# Altium schematic sheet Scheme_E3.SchDoc
size 420 x 297 mm; CheckedBy: Суворов; Address1: Address1; Address2: Address2; Address3: Address3; Address4: Address4; DocumentNumber: АБВГ.941319.001 Э3; SheetNumber: 1; SheetTotal: 1; DocumentType: Схема электрическая принципиальная; FirstReferrence: АБВГ.941319.001; DevelopedBy: Паймин; University: МГТУ им. Н. Э. Баумана; Department: Кафедра СМ5; Group: Группа СМ5-71; Title2str: Малогабаритный; Title3str: биопульсомер; TotalSheets: 1
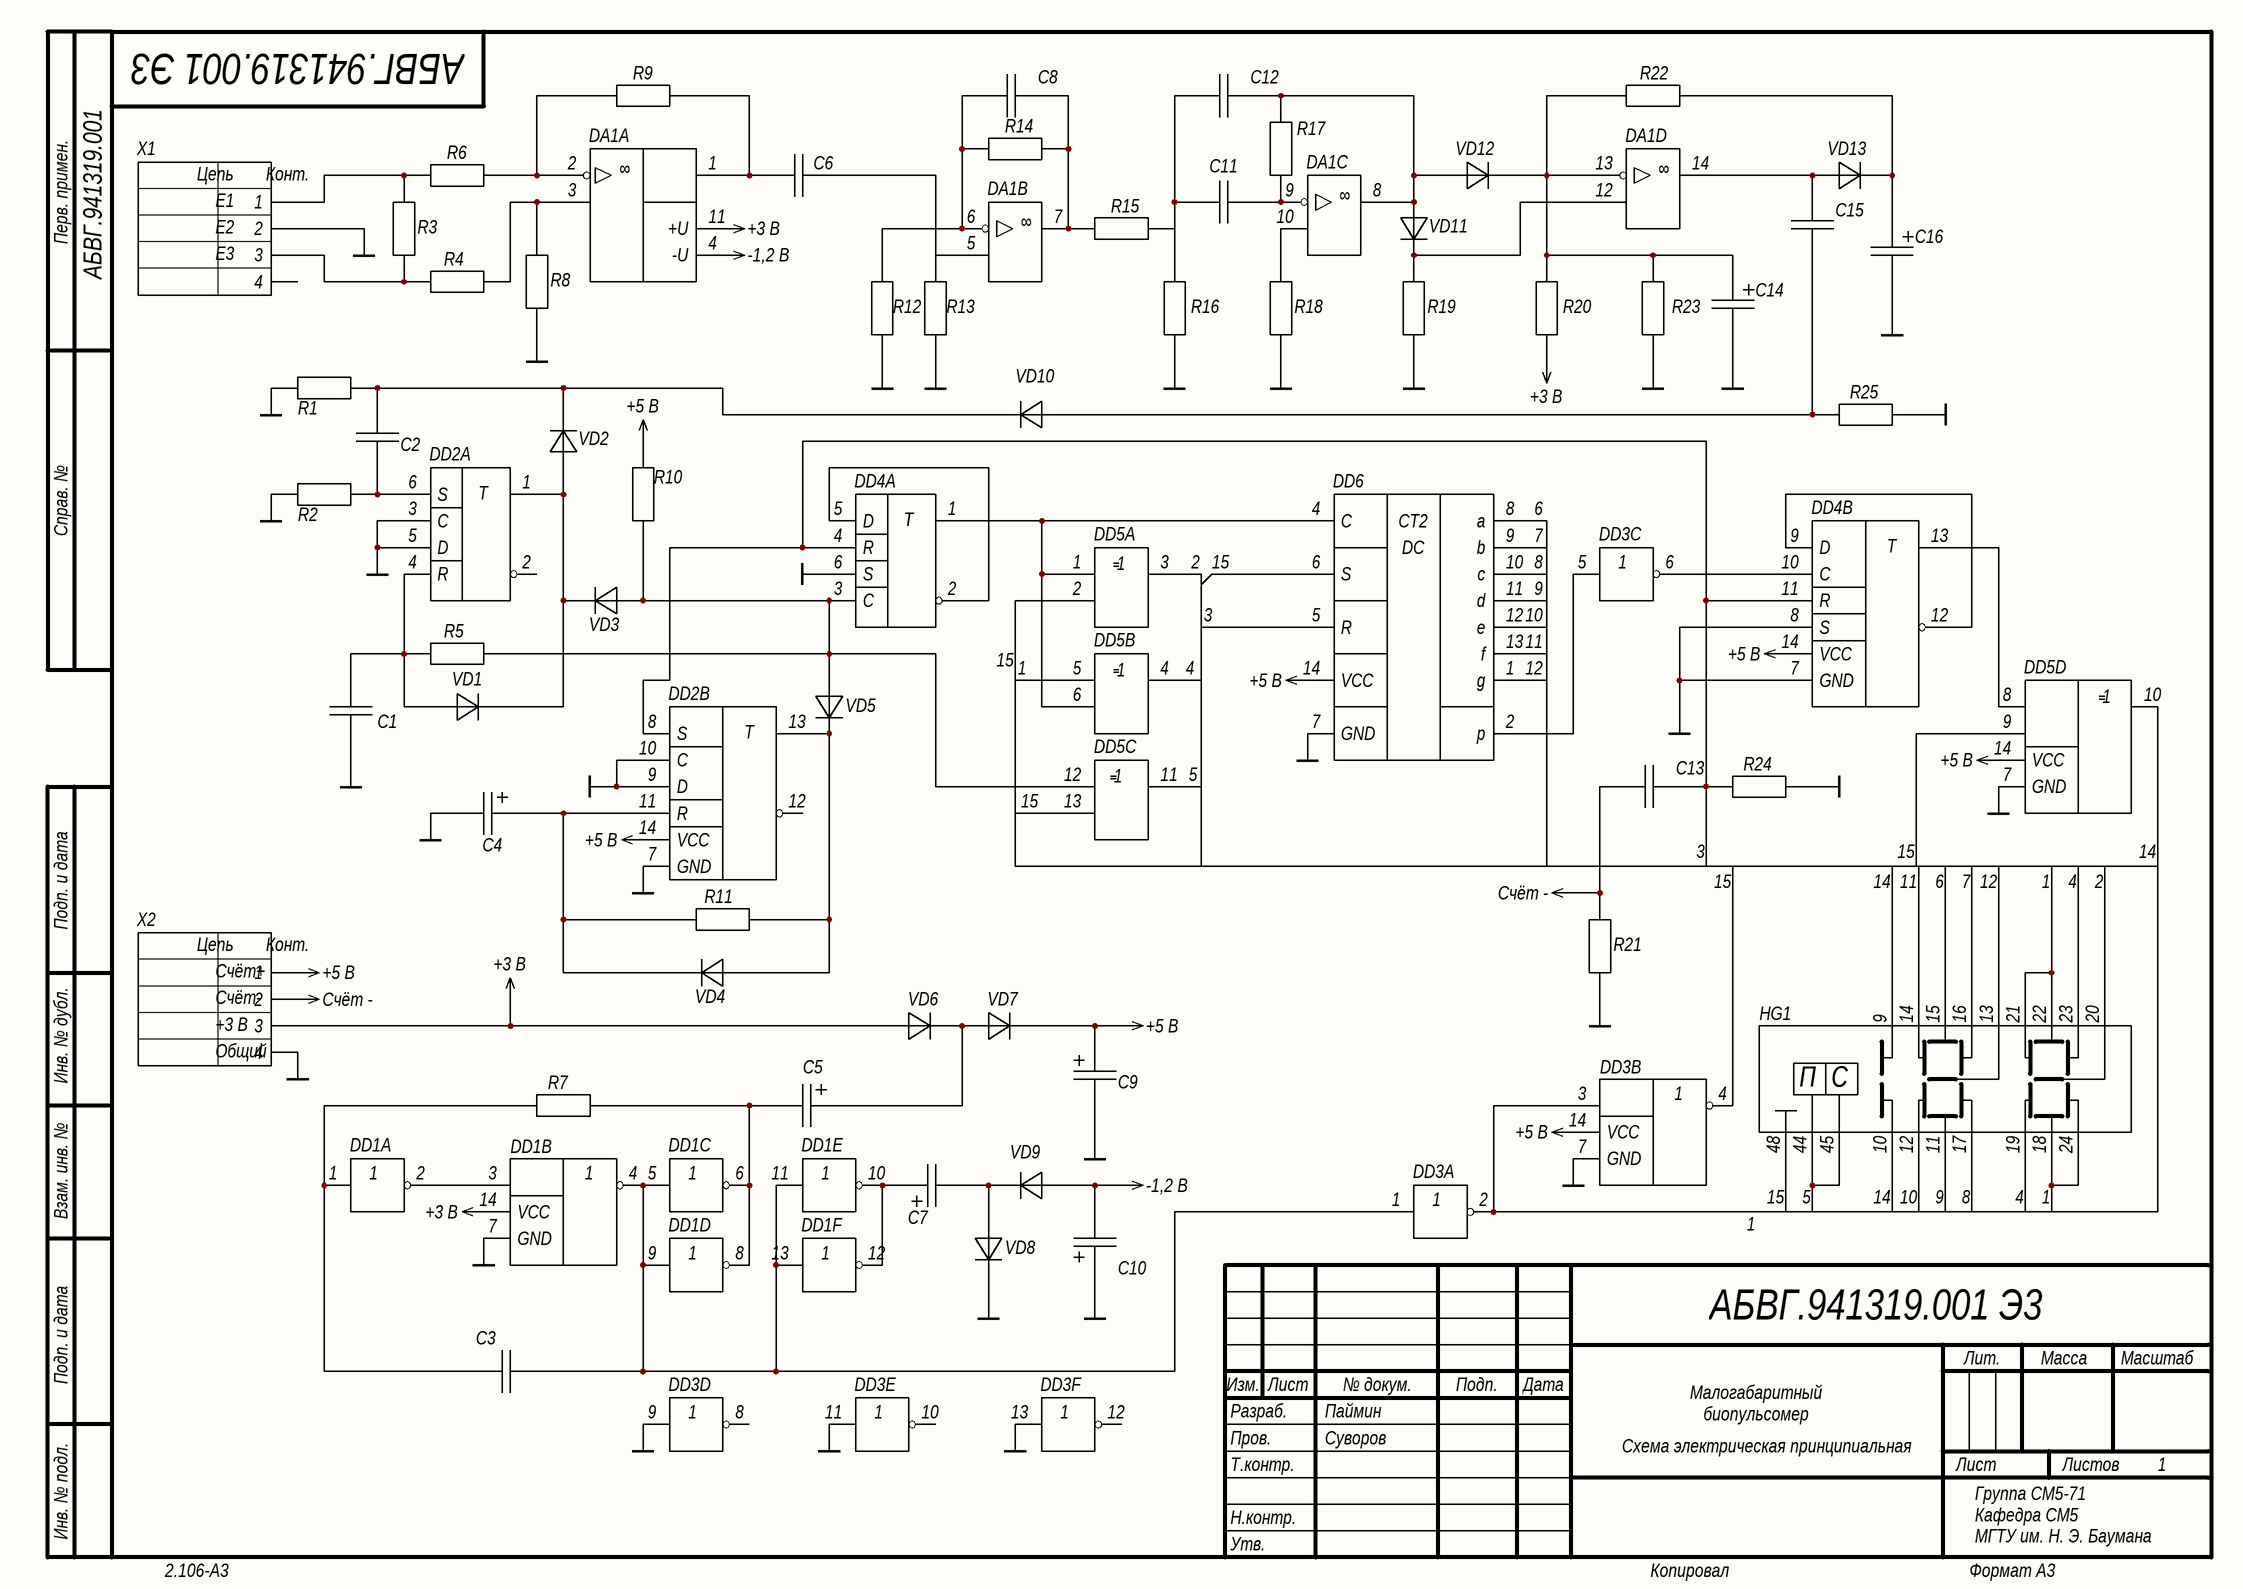
[diagram p0: Scheme_E3.SchDoc]

## Parts
C1  0.47мк  [1210_CAP]  (value not drawn)
C2  0.1мк  [1210_CAP]  (value not drawn)
C3  6800  [1210_CAP]  (value not drawn)
C4  22мк  [CAP_CASE_C]  (value not drawn)
C5  2.2мк  [CAP_CASE_A]  (value not drawn)
C6  0,15мк  [1210_CAP]  (value not drawn)
C7  2.2мк  [CAP_CASE_A]  (value not drawn)
C8  4700  [1206_CAP]  (value not drawn)
C9  4.7мк  [CAP_CASE_B]  (value not drawn)
C10  4.7мк  [CAP_CASE_B]  (value not drawn)
C11  0.068мк  [1210_CAP]  (value not drawn)
C12  0.068мк  [1210_CAP]  (value not drawn)
C13  0.1мк  [1210_CAP]  (value not drawn)
C14  100мк  [CAP_CASE_D]  (value not drawn)
C15  0.15мк  [1210_CAP]  (value not drawn)
C16  10мк  [CAP_CASE_B]  (value not drawn)
DA1  К1401УД2А бК0.348.651-02ТУ  [201.14-8]  (value not drawn)  (parts A,B,C,D of 4)
DD1  К561ЛН2 бК0.348.457-12ТУ  [SOIC-14]  (value not drawn)  (parts A,B,C,D,E,F of 6)
DD2  К561ТМ2 бК0.348.047-02ТУ  [201.14-1]  (value not drawn)  (parts A,B of 2)
DD3  К561ЛН2 бК0.348.457-12ТУ  [SOIC-14]  (value not drawn)  (parts A,B,C,D,E,F of 6)
DD4  К561ТМ2 бК0.348.047-02ТУ  [201.14-1]  (value not drawn)  (parts A,B of 2)
DD5  К561ЛП2 бК0.348.457-05ТУ  [201.14-1]  (value not drawn)  (parts A,B,C,D of 4)
DD6  К176ИЕ4 бК0.348.047-06ТУ  [201.14-1]  (value not drawn)
HG1  ЦИЖ-9 ОД0.339.198 ТУ  [TsIZh-9]  (value not drawn)
R1  100к  [0805_RES]  (value not drawn)
R2  100к  [0805_RES]  (value not drawn)
R3  220к  [0805_RES]  (value not drawn)
R4  220к  [0805_RES]  (value not drawn)
R5  910к  [0805_RES]  (value not drawn)
R6  220к  [0805_RES]  (value not drawn)
R7  220к  [0805_RES]  (value not drawn)
R8  3,9М  [0805_RES]  (value not drawn)
R9  3,9М  [0805_RES]  (value not drawn)
R10  100к  [0805_RES]  (value not drawn)
R11  1,8М  [0805_RES]  (value not drawn)
R12  10к  [0805_RES]  (value not drawn)
R13  100к  [0805_RES]  (value not drawn)
R14  1,6М  [0805_RES]  (value not drawn)
R15  68к  [0805_RES]  (value not drawn)
R16  27к  [0805_RES]  (value not drawn)
R17  1,2М  [0805_RES]  (value not drawn)
R18  100к  [0805_RES]  (value not drawn)
R19  20к  [0805_RES]  (value not drawn)
R20  3,9М  [0805_RES]  (value not drawn)
R21  1М  [0805_RES]  (value not drawn)
R22  56к  [0805_RES]  (value not drawn)
R23  20к  [0805_RES]  (value not drawn)
R24  20к  [0805_RES]  (value not drawn)
R25  100к  [0805_RES]  (value not drawn)
VD1  КД103А ТТ3.362.082ТУ  [KD103A]  (value not drawn)
VD2  КД103А ТТ3.362.082ТУ  [KD103A]  (value not drawn)
VD3  КД103А ТТ3.362.082ТУ  [KD103A]  (value not drawn)
VD4  КД103А ТТ3.362.082ТУ  [KD103A]  (value not drawn)
VD5  КД103А ТТ3.362.082ТУ  [KD103A]  (value not drawn)
VD6  Д9Е аА0.336.473ТУ  [D9E]  (value not drawn)
VD7  Д9Е аА0.336.473ТУ  [D9E]  (value not drawn)
VD8  Д9Е аА0.336.473ТУ  [D9E]  (value not drawn)
VD9  Д9Е аА0.336.473ТУ  [D9E]  (value not drawn)
VD10  Д9Е аА0.336.473ТУ  [D9E]  (value not drawn)
VD11  Д9Е аА0.336.473ТУ  [D9E]  (value not drawn)
VD12  Д9Е аА0.336.473ТУ  [D9E]  (value not drawn)
VD13  КД103А ТТ3.362.082ТУ  [KD103A]  (value not drawn)
X1  СНП368-4РО21-2 ОТК РЮМК.430420.076 ТУ  [MOLEX_0430450427]  (value not drawn)
X2  СНП368-4РО21-2 ОТК РЮМК.430420.076 ТУ  [MOLEX_0430450427]  (value not drawn)

## Nets
+3 В: DA1.11(+U) DD1.14(VCC) R20.1 VD6.A X2.3
+5 В: C9.1 DD2.14(VCC) DD3.14(VCC) DD4.14(VCC) DD5.14(VCC) DD6.14(VCC) R10.2 VD7.K X2.1
-1,2 В: C10.2 DA1.4(-U) VD9.A
NetC1_2: C1.2 C4.2 C9.2 C10.1 C14.2 C16.2 DD1.7(GND) DD2.3(C) DD2.5(D) DD2.7(GND) DD2.9(D) DD2.10(C) DD3.7(GND) DD3.9 DD3.11 DD3.13 DD4.6(S) DD4.7(GND) DD4.8(S) DD5.7(GND) DD6.7(GND) R1.2 R2.2 R8.1 R12.1 R13.1 R16.1 R18.1 R19.1 R21.1 R23.1 R24.2 R25.1 VD8.K X1.2 X2.4
Счёт -: C13.2 R21.2 X2.2
1: DD3.2 DD3.3 DD5.5 HG1.18 HG1.21 HG1.22 HG1.24
2: DD5.3 HG1.20
3: C13.1 DD2.8(S) DD4.4(R) DD4.11(R) DD6.5(R) R24.1
4: DD5.4 HG1.19 HG1.23
5: DD5.11 HG1.44 HG1.45
6: DD6.8(a) HG1.15
7: DD6.9(b) HG1.16
8: DD6.10(c) HG1.17
9: DD6.11(d) HG1.11
10: DD6.12(e) HG1.12
11: DD6.13(f) HG1.14
12: DD6.1(g) HG1.13
14: DD5.10 HG1.9 HG1.10
15: DD3.4 DD5.2 DD5.9 DD5.13 DD6.6(S) HG1.48
NetC1_1: C1.1 DD2.4(R) R5.1 VD1.A
NetC2_1: C2.1 DD2.6(S) R2.1
NetC2_2: C2.2 R1.1 VD2.K VD10.K
NetC3_1: C3.1 DD1.4 DD1.5 DD1.9 DD1.11 DD1.13 DD3.1
NetC3_2: C3.2 DD1.1 R7.1
NetC4_1: C4.1 DD2.11(R) R11.1 VD4.K
NetC5_1: C5.1 VD6.K VD7.A
NetC5_2: C5.2 DD1.6 DD1.8 R7.2
NetC6_1: C6.1 DA1.5 R13.2
NetC6_2: C6.2 DA1.1 R9.2
NetC7_1: C7.1 DD1.10 DD1.12
NetC7_2: C7.2 VD8.A VD9.K
NetC8_1: C8.1 DA1.7 R14.2 R15.1
NetC8_2: C8.2 DA1.6 R12.2 R14.1
NetC11_1: C11.1 DA1.9 R17.1
NetC11_2: C11.2 C12.2 R15.2 R16.2
NetC12_1: C12.1 DA1.8 R17.2 VD11.A VD12.A
NetC14_1: C14.1 DA1.13 R20.2 R22.1 R23.2 VD12.K
NetC15_1: C15.1 R25.2 VD10.A
NetC15_2: C15.2 DA1.14 VD13.A
NetC16_1: C16.1 R22.2 VD13.K
NetDA1_2: DA1.2 R6.2 R9.1
NetDA1_3: DA1.3 R4.2 R8.2
NetDA1_10: DA1.10 R18.2
NetDA1_12: DA1.12 R19.2 VD11.K
NetDD1_2: DD1.2 DD1.3
NetDD2_1: DD2.1(Q) VD1.K VD2.A VD3.K
NetDD2_13: DD2.13(Q) R11.2 VD4.A VD5.K
NetDD3_5: DD3.5 DD6.2(p)
NetDD3_6: DD3.6 DD4.10(C)
NetDD4_1: DD4.1(Q) DD5.1 DD5.6 DD6.4(C)
NetDD4_2: DD4.2(#Q) DD4.5(D)
NetDD4_3: DD4.3(C) DD5.12 R5.2 R10.1 VD3.A VD5.A
NetDD4_9: DD4.9(D) DD4.12(#Q)
NetDD4_13: DD4.13(Q) DD5.8
NetR3_1: R3.1 R4.1 X1.3
NetR3_2: R3.2 R6.1 X1.1

Not connected (* = marked no-connect by the designer): DD2 2(#Q) 12(#Q); DD3 8 10 12; X1 4

## Notes on the sheet
- Перв. примен.
- Справ. №
- Подп. и дата
- Инв. № дубл.
- Взам. инв. №
- Разраб.
- Изм.
- Лист
- № докум.
- Подп.
- Дата
- Лит.
- Масса
- Масштаб
- Пров.
- Т.контр.
- Листов
- Инв. № подл.
- Утв.
- Н.контр.
- 2.106-A3
- Копировал
- Формат А3
- (in symbol Header 2x2) Цепь; Конт.
- (in symbol K176IE4) CT2; DC
- (in symbol K176TM2, part A) T
- (in symbol K176TM2, part B) T
- (in symbol K1401UD2A, part A) ∞
- (in symbol K1401UD2A, part B) ∞
- (in symbol K1401UD2A, part C) ∞
- (in symbol K1401UD2A, part D) ∞
- (in symbol TsIZh-9) П; С

## Buses and harness runs
bus 

## Library data of the parts
C1 = Capacitor: ValueManufacturerPartNumber: К10-17в-Н90-0.47мк±10%-4 ОЖО.460.107 ТУ; Tolerance: ±10%; ValueDescription: Конденсатор; Dielectric: Н90; Voltage: 50; Case: 1210; Power: *; Temp: *; URL: *; Value: 0.47мк; ValueManufacturer: *; ValueType: Конденсатор; ESR: *
C2 C13 = Capacitor: ValueManufacturerPartNumber: К10-17в-Н90-0.1мк±10%-4 ОЖО.460.107 ТУ; Tolerance: ±10%; ValueDescription: Конденсатор; Dielectric: Н90; Voltage: 50; Case: 1210; Power: *; Temp: *; URL: *; Value: 0.1мк; ValueManufacturer: *; ValueType: Конденсатор; ESR: *
C3 = Capacitor: ValueManufacturerPartNumber: К10-17в-Н90-6800±10%-4 ОЖО.460.107 ТУ; Tolerance: ±10%; ValueDescription: Конденсатор; Dielectric: Н90; Voltage: 50; Case: 1210; Power: *; Temp: *; URL: *; Value: 6800; ValueManufacturer: *; ValueType: Конденсатор; ESR: *
C4 = Capacitor_pol: ValueManufacturerPartNumber: К53-56а-6.3В-22мк±10% АДПК.673546.005 ТУ; ValueDescription: Конденсатор; ValueType: Полярный конденсатор; Value: 22мк
C5 C7 = Capacitor_pol: ValueManufacturerPartNumber: К53-56а-10В-2.2мк±10% АДПК.673546.005 ТУ; ValueDescription: Конденсатор; ValueType: Полярный конденсатор; Value: 2.2мк
C6 C15 = Capacitor: ValueManufacturerPartNumber: К10-17в-Н90-0.15мк±10%-4 ОЖО.460.107 ТУ; Tolerance: ±10%; ValueDescription: Конденсатор; Dielectric: Н90; Voltage: 50; Case: 1210; Power: *; Temp: *; URL: *; ValueManufacturer: *; ValueType: Конденсатор; ESR: *
  C6: Value: 0,15мк
  C15: Value: 0.15мк
C8 = Capacitor: ValueManufacturerPartNumber: К10-17в-Н90-4700±10%-3 ОЖО.460.107 ТУ; Tolerance: ±10%; ValueDescription: Конденсатор; Dielectric: Н90; Voltage: 50; Case: 1206; Power: *; Temp: *; URL: *; Value: 4700; ValueManufacturer: *; ValueType: Конденсатор; ESR: *
C9 C10 = Capacitor_pol: ValueManufacturerPartNumber: К53-56а-10В-4.7мк±10% АДПК.673546.005 ТУ; ValueDescription: Конденсатор; ValueType: Полярный конденсатор; Value: 4.7мк
C11 C12 = Capacitor: ValueManufacturerPartNumber: К10-17в-Н90-0.068мк±10%-4 ОЖО.460.107 ТУ; Tolerance: ±10%; ValueDescription: Конденсатор; Dielectric: Н90; Voltage: 50; Case: 1210; Power: *; Temp: *; URL: *; Value: 0.068мк; ValueManufacturer: *; ValueType: Конденсатор; ESR: *
C14 = Capacitor_pol: ValueManufacturerPartNumber: К53-56а-6.3В-100мк±10% АДПК.673546.005 ТУ; ValueDescription: Конденсатор; ValueType: Полярный конденсатор; Value: 100мк
C16 = Capacitor_pol: ValueManufacturerPartNumber: К53-56а-6.3В-10мк±10% АДПК.673546.005 ТУ; ValueDescription: Конденсатор; ValueType: Полярный конденсатор; Value: 10мк
DA1 = K1401UD2A: ValueDescription: Микросхема; ValueManufacturerPartNumber: К1401УД2А бК0.348.651-02ТУ
DD1 DD3 = K561LN2: ValueDescription: Микросхема; ValueManufacturerPartNumber: К561ЛН2 бК0.348.457-12ТУ
DD2 DD4 = K176TM2: ValueDescription: Микросхема; ValueManufacturerPartNumber: К561ТМ2 бК0.348.047-02ТУ
DD5 = K561LP2: ValueDescription: Микросхема; ValueManufacturerPartNumber: К561ЛП2 бК0.348.457-05ТУ
DD6 = K176IE4: ValueDescription: Микросхема; ValueManufacturerPartNumber: К176ИЕ4 бК0.348.047-06ТУ
HG1 = TsIZh-9: ValueDescription: Индикатор символьный; ValueManufacturerPartNumber: ЦИЖ-9 ОД0.339.198 ТУ
R1 R2 R4-R7 R9 R11 R14 R15 R22 = Resistor_Horizontal: Power: 0,125; ValueDescription: Резистор; ValueType: Резистор; Case: 0805; URL: *; Temp: *; Tolerance: *
  R1: ValueManufacturerPartNumber: ="Р1-8-"+Power+"-"+Value+"Ом±5%-Л-П ОЖО.467.164 ТУ"; Value: 100к
  R2: Value: 100к
  R4 R6 R7: Value: 220к
  R5: Value: 910к
  R9: Value: 3,9М
  R11: Value: 1,8М
  R14: Value: 1,6М
  R15: Value: 68к
  R22: Value: 56к
R3 R8 R10 R12 R13 R16-R21 R23-R25 = Resistor_Vertical: Power: 0,125; ValueDescription: Резистор; ValueType: Резистор; URL: *; Temp: *; Tolerance: *
  R3: Value: 220к; Case: *
  R8 R20: Value: 3,9М; Case: 0805
  R10 R13 R18 R25: Value: 100к; Case: 0805
  R12: Value: 10к; Case: 0805
  R16: Value: 27к; Case: 0805
  R17: Value: 1,2М; Case: 0805
  R19 R23 R24: Value: 20к; Case: 0805
  R21: Value: 1М; Case: 0805
VD1-VD13 = Diode: ValueType: Диод
  VD1-VD5 VD13: ValueManufacturerPartNumber: КД103А ТТ3.362.082ТУ
  VD6-VD12: ValueManufacturerPartNumber: Д9Е аА0.336.473ТУ
X1 = Header 2x2: ValueType: Розетка; Str1: E1; Str2: E2; Str3: E3; ValueManufacturerPartNumber: СНП368-4РО21-2 ОТК РЮМК.430420.076 ТУ
X2 = Header 2x2: ValueType: Розетка; Str1: Cчёт+; Str2: Счёт-; Str3: +3 В; Str4: Общий; ValueManufacturerPartNumber: СНП368-4РО21-2 ОТК РЮМК.430420.076 ТУ